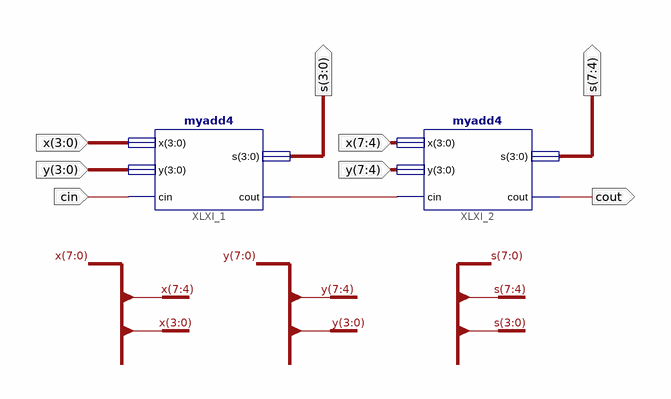
[diagram p0: schematic sheet 1]
// Xilinx ISE schematic myadd8.sch (xc9500) as structural Verilog: 2 symbols, 8 ports
module myadd8 (
  input  [7:0] x,
  input  [7:0] y,
  input  cin,
  output [7:0] s,
  output cout
);

  wire XLXN_5;

  myadd4 XLXI_1 (.x(x[3:0]), .y(y[3:0]), .cin(cin), .s(s[3:0]), .cout(XLXN_5));
  myadd4 XLXI_2 (.x(x[7:4]), .y(y[7:4]), .cin(XLXN_5), .s(s[7:4]), .cout(cout));
endmodule
